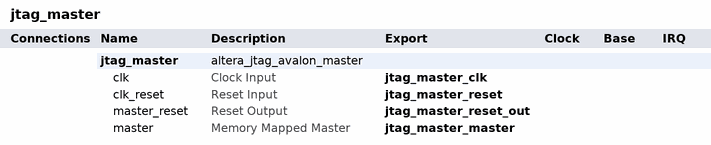
[diagram p0: system contents]
# Platform Designer (Qsys) system jtag_master, Cyclone IV GX Unknown
# Parameters at their usual value, and those the tool derives, are not listed.
package require -exact qsys 13.0
create_system jtag_master
set_project_property DEVICE_FAMILY {Cyclone IV GX}
set_project_property DEVICE Unknown

add_instance jtag_master altera_jtag_avalon_master 13.0

# exported interfaces
add_interface jtag_master_reset_out reset source
set_interface_property jtag_master_reset_out EXPORT_OF jtag_master.master_reset
add_interface jtag_master_master avalon master
set_interface_property jtag_master_master EXPORT_OF jtag_master.master
add_interface jtag_master_reset reset sink
set_interface_property jtag_master_reset EXPORT_OF jtag_master.clk_reset
add_interface jtag_master_clk clock sink
set_interface_property jtag_master_clk EXPORT_OF jtag_master.clk

save_system jtag_master.qsys
